# Altium schematic sheet m11tcp.SchDoc
size A4
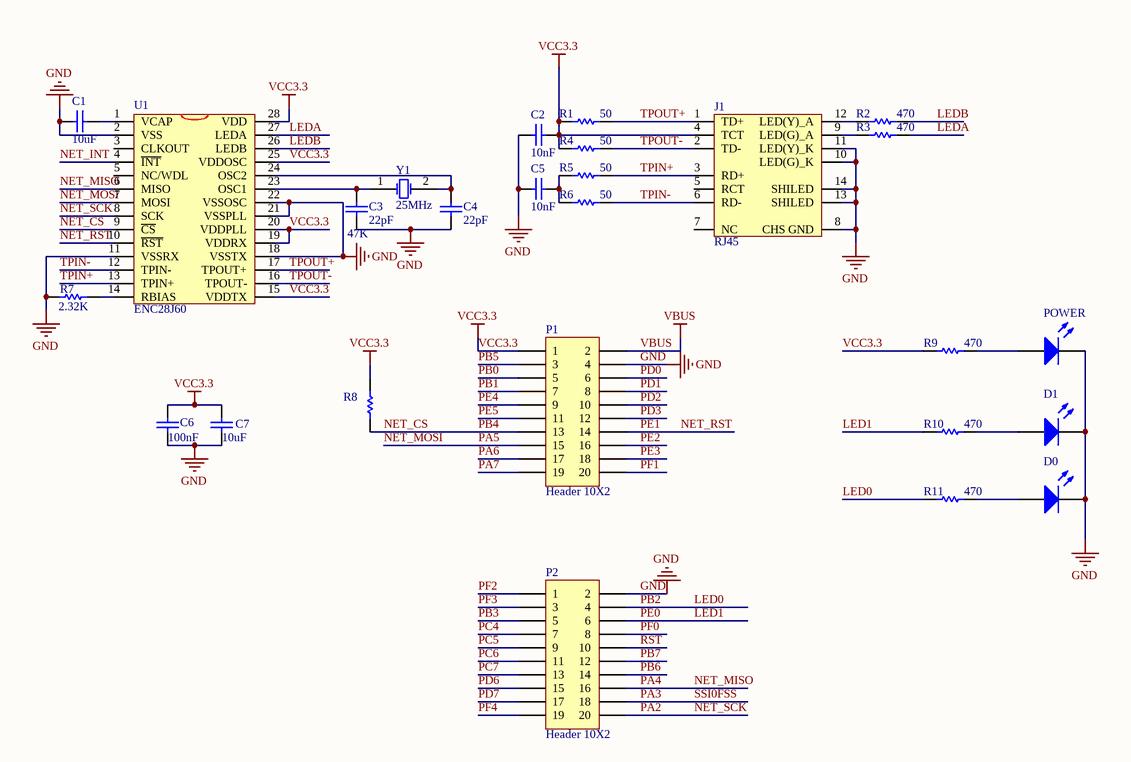
[diagram p0: m11tcp.SchDoc]

## Parts
C1  value 10uF  [CAP_0603]  (hidden comment: Cap Semi)
C2  value 10nF  [CAP_0603]  (hidden comment: Cap Semi)
C3  value 22pF  [CAP_0603]  (hidden comment: Cap Semi)
C4  value 22pF  [CAP_0603]  (hidden comment: Cap Semi)
C5  value 10nF  [CAP_0603]  (hidden comment: Cap Semi)
C6  value 100nF  [CAP_0603]  (hidden comment: Cap Semi)
C7  value 10uF  [CAP_0603]  (hidden comment: Cap Semi)
D0  LED2  [LED_0603_RED]  (value not drawn)
D1  LED2  [LED_0603_RED]  (value not drawn)
J1  RJ45  [HR911105A]
P1  Header 10X2  [HDR2X10]
P2  Header 10X2  [HDR2X10]
POWER  LED2  [LED_0603_RED]  (value not drawn)
R1  value 50  [RES_0603]  (hidden comment: Res Semi)
R2  value 470  [RES_0603]  (hidden comment: Res Semi)
R3  value 470  [RES_0603]  (hidden comment: Res Semi)
R4  value 50  [RES_0603]  (hidden comment: Res Semi)
R5  value 50  [RES_0603]  (hidden comment: Res Semi)
R6  value 50  [RES_0603]  (hidden comment: Res Semi)
R7  value 2.32K  [RES_0603]  (hidden comment: Res Semi)
R8  value 47K  [RES_0603]  (hidden comment: Res Semi)
R9  value 470  [RES_0603]  (hidden comment: Res Semi)
R10  value 470  [RES_0603]  (hidden comment: Res Semi)
R11  value 470  [RES_0603]  (hidden comment: Res Semi)
U1  ENC28J60  [SSOP28]
Y1  25MHz  [XTAL_US]

## Nets
GND: C1.1 C2.1 C3.1 C4.1 C5.1 C6.1 C7.1 D0.2(K) D1.2(K) J1.8(CHS_GND) J1.10(LED(G)_K) J1.11(LED(Y)_K) J1.13(SHILED) J1.14(SHILED) P1.4 P2.2 POWER.2(K) R7.1 U1.2(VSS) U1.11(VSSRX) U1.18(VSSTX) U1.21(VSSPLL) U1.22(VSSOSC)
VBUS: P1.2
VCC3.3: C2.2 C6.2 C7.2 J1.4(TCT) P1.1 R1.1 R4.1 R8.2 R9.1 U1.15(VDDTX) U1.19(VDDRX) U1.20(VDDPLL) U1.25(VDDOSC) U1.28(VDD)
LED0: P2.4 R11.1  [also labelled PB2]
LED1: P2.6 R10.1  [also labelled PE0]
LEDA: R3.2 U1.27(LEDA)
LEDB: R2.2 U1.26(LEDB)
NET_CS: P1.13 R8.1 U1.9(~{CS})  [also labelled PB4]
NET_INT: U1.4(~{INT})
NET_MISO: P2.16 U1.6(MISO)  [also labelled PA4]
NET_MOSI: P1.15 U1.7(MOSI)  [also labelled PA5]
NET_RST: P1.14 U1.10(~{RST})  [also labelled PE1]
NET_SCK: P2.20 U1.8(SCK)  [also labelled PA2]
PA3: P2.18  [also labelled SSI0FSS]
PA6: P1.17
PA7: P1.19
PB0: P1.5
PB1: P1.7
PB3: P2.5
PB5: P1.3
PB6: P2.14
PB7: P2.12
PC4: P2.7
PC5: P2.9
PC6: P2.11
PC7: P2.13
PD0: P1.6
PD1: P1.8
PD2: P1.10
PD3: P1.12
PD6: P2.15
PD7: P2.17
PE2: P1.16
PE3: P1.18
PE4: P1.9
PE5: P1.11
PF0: P2.8
PF1: P1.20
PF2: P2.1
PF3: P2.3
PF4: P2.19
RST: P2.10
TPIN+: J1.3(RD+) R5.2 U1.13(TPIN+)
TPIN-: J1.6(RD-) R6.2 U1.12(TPIN-)
TPOUT+: J1.1(TD+) R1.2 U1.17(TPOUT+)
TPOUT-: J1.2(TD-) R4.2 U1.16(TPOUT-)
NetC1_2: C1.2 U1.1(VCAP)
NetC3_2: C3.2 U1.23(OSC1) Y1.1(OSC1)
NetC4_2: C4.2 U1.24(OSC2) Y1.2(OSC2)
NetC5_2: C5.2 R5.1 R6.1
NetD0_1: D0.1(A) R11.2
NetD1_1: D1.1(A) R10.2
NetJ1_9: J1.9(LED(G)_A) R3.1
NetJ1_12: J1.12(LED(Y)_A) R2.1
NetPOWER_1: POWER.1(A) R9.2
NetR7_2: R7.2 U1.14(RBIAS)

Not connected (* = marked no-connect by the designer): J1 5(RCT) 7(NC); U1 3(CLKOUT) 5(NC/WDL)

## Library data of the parts
C1-C7 = Cap Semi: Capacitor (Semiconductor SIM Model); Published: 8-Jun-2000; LatestRevisionDate: 29-May-2009; LatestRevisionNote: IPC-7351 Footprint Added.; PackageReference: C1206; Publisher: Altium Limited; PackageDescription: Chip Capacitor
D0 D1 POWER = LED2: Typical RED, GREEN, YELLOW, AMBER GaAs LED; Published: 8-Jun-2000; LatestRevisionDate: 17-Jul-2002; LatestRevisionNote: Re-released for DXP Platform.; PackageVersion: Feb-2002; PackageReference: 3.2X1.6X1.1; Publisher: Altium Limited
J1 = HR911105
P1 P2 = Header 10X2: Header, 10-Pin, Dual row; LatestRevisionDate: 17-Jul-2002; LatestRevisionNote: Re-released for DXP Platform.; Publisher: Altium Limited
R1-R11 = Res Semi: Semiconductor Resistor; Published: 8-Jun-2000; LatestRevisionDate: 17-Jul-2002; LatestRevisionNote: Re-released for DXP Platform.; PackageReference: AXIAL-0.5; Publisher: Altium Limited
Y1 = XTAL: Crystal Oscillator; Published: 8-Jun-2000; LatestRevisionDate: 17-Jul-2002; LatestRevisionNote: Re-released for DXP Platform.; Publisher: Altium Limited